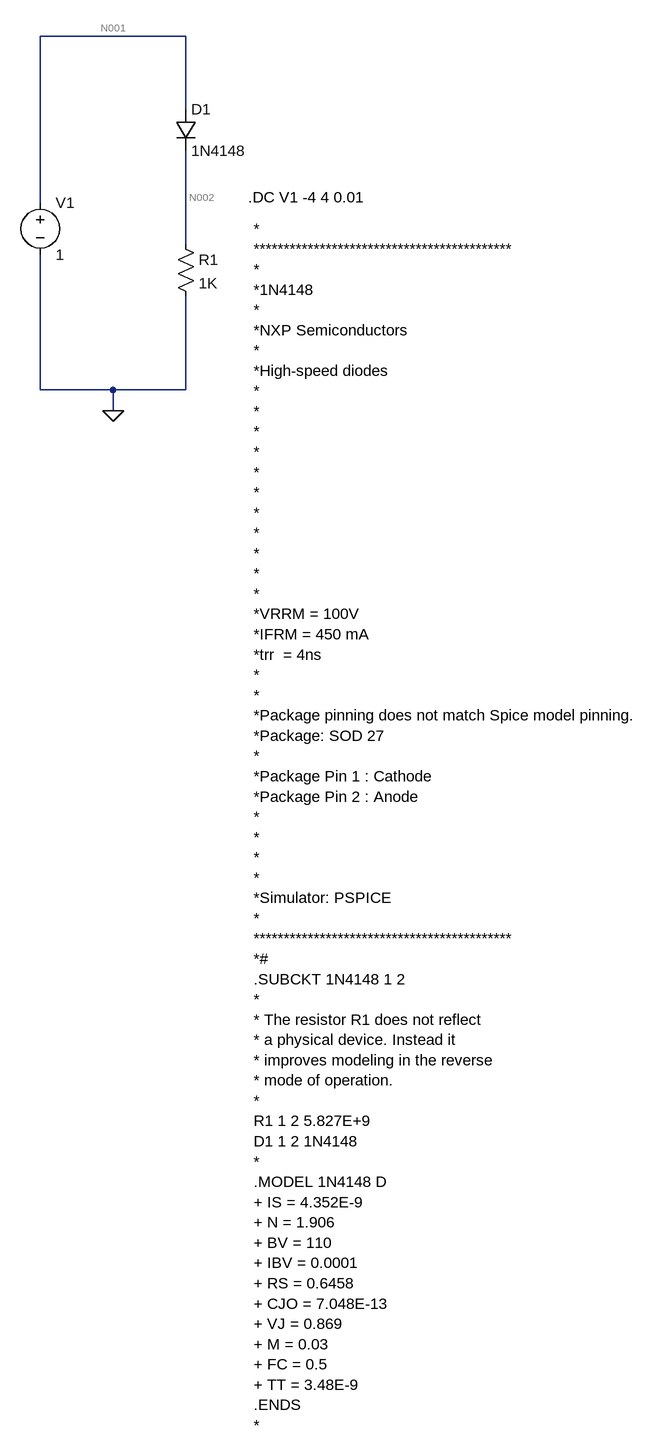
[diagram p0: schematic Draft1.asc]
Draft1.asc, the LTspice schematic file:
Version 4
SHEET 1 1036 1836
WIRE 288 -128 64 -128
WIRE 288 -16 288 -128
WIRE 64 128 64 -128
WIRE 288 192 288 48
WIRE 64 416 64 208
WIRE 176 416 64 416
WIRE 288 416 288 272
WIRE 288 416 176 416
WIRE 176 448 176 416
FLAG 176 448 0
SYMBOL voltage 64 112 R0
WINDOW 123 0 0 Left 0
WINDOW 39 0 0 Left 0
SYMATTR InstName V1
SYMATTR Value 1
SYMBOL res 272 176 R0
SYMATTR InstName R1
SYMATTR Value 1K
SYMBOL diode 272 -16 R0
SYMATTR InstName D1
SYMATTR Value 1N4148
TEXT 384 120 Left 2 !.DC V1 -4 4 0.01
TEXT 392 168 Left 2 !*\n*******************************************\n*\n*1N4148\n*\n*NXP Semiconductors\n*\n*High-speed diodes\n*\n*\n*\n*\n* \n*\n*\n*\n*\n*\n*\n*VRRM = 100V\n*IFRM = 450 mA \n*trr  = 4ns\n*\n*\n*Package pinning does not match Spice model pinning.\n*Package: SOD 27\n*\n*Package Pin 1 : Cathode\n*Package Pin 2 : Anode\n*\n*\n*\n*\n*Simulator: PSPICE\n*\n*******************************************\n*#\n.SUBCKT 1N4148 1 2 \n*\n* The resistor R1 does not reflect \n* a physical device. Instead it\n* improves modeling in the reverse \n* mode of operation.\n*\nR1 1 2 5.827E+9 \nD1 1 2 1N4148\n*\n.MODEL 1N4148 D \n+ IS = 4.352E-9 \n+ N = 1.906 \n+ BV = 110 \n+ IBV = 0.0001 \n+ RS = 0.6458 \n+ CJO = 7.048E-13 \n+ VJ = 0.869 \n+ M = 0.03 \n+ FC = 0.5 \n+ TT = 3.48E-9 \n.ENDS\n*

The netlist it stands for:
* Draft1.asc
V1 N001 0 1
R1 N002 0 1K
D1 N001 N002 1N4148
.model D D
.lib standard.dio
.DC V1 -4 4 0.01
*
*******************************************
*
*1N4148
*
*NXP Semiconductors
*
*High-speed diodes
*
*
*
*
*
*
*
*
*
*
*
*VRRM = 100V
*IFRM = 450 mA
*trr  = 4ns
*
*
*Package pinning does not match Spice model pinning.
*Package: SOD 27
*
*Package Pin 1 : Cathode
*Package Pin 2 : Anode
*
*
*
*
*Simulator: PSPICE
*
*******************************************
*#
.SUBCKT 1N4148 1 2
*
* The resistor R1 does not reflect
* a physical device. Instead it
* improves modeling in the reverse
* mode of operation.
*
R1 1 2 5.827E+9
D1 1 2 1N4148
*
.MODEL 1N4148 D
+ IS = 4.352E-9
+ N = 1.906
+ BV = 110
+ IBV = 0.0001
+ RS = 0.6458
+ CJO = 7.048E-13
+ VJ = 0.869
+ M = 0.03
+ FC = 0.5
+ TT = 3.48E-9
.ENDS
*
.backanno
.end

* Results of the author's LTspice run, read from the files saved beside the schematic
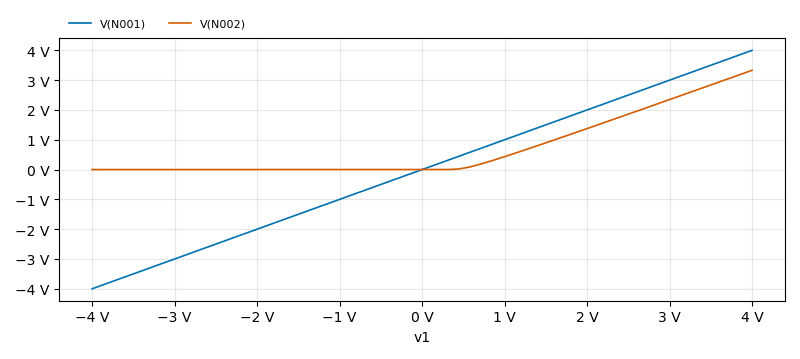
[diagram p1: DC transfer characteristic of Draft1.asc, plotted from the saved traces]
* DC transfer characteristic, 1 run:
*   V(N001): -4 V at v1=-4 V, 4 V at v1=4 V, min -4 V, max 4 V
*   V(N002): -5.042 µV at v1=-4 V, 3.33 V at v1=4 V, min -5.042 µV, max 3.33 V